# Altium schematic sheet 010_Current_Sensor.SchDoc
size A4; SheetNumber: 4; SheetTotal: 4; SPICEModelCacheXCDJKUEN: <root> / <DocumentId>XCDJKUEN</DocumentId> / <CacheFrame Number="0"> / <Model Name="875075761007_68uf" Kind="CKT"> / <Text>******* / .subckt 875075761007_68uF 1 2 / Rser 1 3 0.0108114773899 / Lser 2 4 5.10636587E-09 / C1 3 4 0.000068 / Rpar 3 4 73529.4117647059 / .ends 875075761007_68uF</Text> / </Model> / </CacheFrame> / </root>
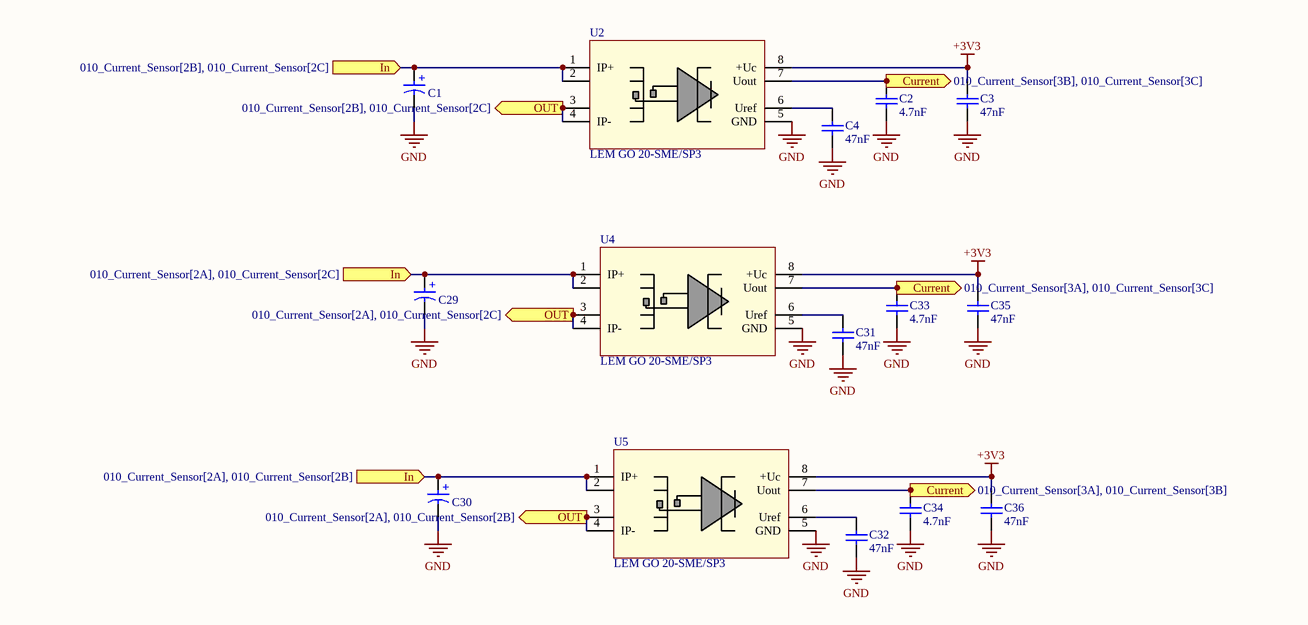
[diagram p0: 010_Current_Sensor.SchDoc]

## Parts
C1  68µF  [WCAP-PSLC_D10H12.4]  (value not drawn)
C2  4.7nF  [WCAP-CSGP_0805_L2W1.25H0.8_Reflow]
C3  47nF  [WCAP-CSGP_0805_L2W1.25H0.8_Reflow]
C4  47nF  [WCAP-CSGP_0805_L2W1.25H0.8_Reflow]
C29  68µF  [WCAP-PSLC_D10H12.4]  (value not drawn)
C30  68µF  [WCAP-PSLC_D10H12.4]  (value not drawn)
C31  47nF  [WCAP-CSGP_0805_L2W1.25H0.8_Reflow]
C32  47nF  [WCAP-CSGP_0805_L2W1.25H0.8_Reflow]
C33  4.7nF  [WCAP-CSGP_0805_L2W1.25H0.8_Reflow]
C34  4.7nF  [WCAP-CSGP_0805_L2W1.25H0.8_Reflow]
C35  47nF  [WCAP-CSGP_0805_L2W1.25H0.8_Reflow]
C36  47nF  [WCAP-CSGP_0805_L2W1.25H0.8_Reflow]
U2  LEM GO 20-SME/SP3  [Lem_sme_SOIC8]
U4  LEM GO 20-SME/SP3  [Lem_sme_SOIC8]
U5  LEM GO 20-SME/SP3  [Lem_sme_SOIC8]

## Ports
Current (out, see 010_Current_Sensor[3A], 010_Current_Sensor[3B]), Current (out, see 010_Current_Sensor[3A], 010_Current_Sensor[3C]), Current (out, see 010_Current_Sensor[3B], 010_Current_Sensor[3C]), In (in, see 010_Current_Sensor[2A], 010_Current_Sensor[2B]), In (in, see 010_Current_Sensor[2A], 010_Current_Sensor[2C]), In (in, see 010_Current_Sensor[2B], 010_Current_Sensor[2C]), OUT (out, see 010_Current_Sensor[2A], 010_Current_Sensor[2B]), OUT (out, see 010_Current_Sensor[2A], 010_Current_Sensor[2C]), OUT (out, see 010_Current_Sensor[2B], 010_Current_Sensor[2C])

## Nets
+3V3: C3.2 C35.2 C36.2 U2.8(+Uc) U4.8(+Uc) U5.8(+Uc)
GND: C1.2(N) C2.1 C3.1 C4.1 C29.2(N) C30.2(N) C31.1 C32.1 C33.1 C34.1 C35.1 C36.1 U2.5(GND) U4.5(GND) U5.5(GND)
Current: C2.2 C33.2 C34.2 U2.7(Uout) U4.7(Uout) U5.7(Uout) ; port Current
In: C1.1(P) C29.1(P) C30.1(P) U2.1(IP+) U2.2 U4.1(IP+) U4.2 U5.1(IP+) U5.2 ; port In
OUT: U2.3 U2.4(IP-) U4.3 U4.4(IP-) U5.3 U5.4(IP-) ; port OUT
NetC4_2: C4.2 U2.6(Uref)
NetC31_2: C31.2 U4.6(Uref)
NetC32_2: C32.2 U5.6(Uref)

## Notes on the sheet
- (in symbol 875075761007) +

## Library data of the parts
C1 C29 C30 = 875075761007: WCAP-PSLC Aluminum Polymer Capacitor, V-Chip SMT, D10 x H12.4mm, 68µF, 50V; Manufacturer: Wurth Elektronik; Capacitance Tolerance: +/-20%; Dissipation Factor: 12%; Endurance: 2000h; ESR: 35mΩ; Leakage Current: 680µA; Ripple Current: 2000mA; Technical Reference: PSEF124680M050DVCTFB000; Manufacturer Part Number: 875075761007; Category: Aluminum Polymer Capacitors; Match Code: WCAP-PSLC; ComponentLink1Description: Website Link; ComponentLink1URL: https://www.we-online.com/redexpert/article/875075761007?ad; ComponentLink2Description: Datasheet Link; ComponentLink2URL: https://www.we-online.com/redexpert/spec/875075761007?ad; Mount: Surface Mount; Operating Temperature Max: 105°C; Operating Temperature Min: -55°C; Packaging: Tape and Reel; Height: 12.4mm; Diameter: 10mm; Capacitance: 68µF; Rated Voltage (DC): 50V
C2 C33 C34 = 885012207090: WCAP-CSGP Multilayer Ceramic Chip Capacitor, General Purpose, size 0805, X7R, 4.7nF, 50VDC; Manufacturer: Wurth Elektronik; Case/Size Code: 0805; Capacitance Tolerance: +/-10%; Dissipation Factor: 2.5%; Insulation Resistance: 10GΩ; Rated Voltage (DC): 50V; Technical Reference: X7R0805472K050DFCT10000; Manufacturer Part Number: 885012207090; Category: Multilayer Ceramic Chip Capacitors; Match Code: WCAP-CSGP; ComponentLink1Description: Website Link; ComponentLink1URL: https://www.we-online.com/redexpert/article/885012207090?ad; ComponentLink2Description: Datasheet Link; ComponentLink2URL: https://www.we-online.com/redexpert/spec/885012207090?ad; Mount: Surface Mount; Operating Temperature Max: 125°C; Operating Temperature Min: -55°C; Packaging: Tape and Reel; Length: 2mm; Width: 1.25mm; Height: 0.8mm; Capacitance: 4.7nF; Ceramic Type: X7R
C3 C4 C31 C32 C35 C36 = 885012207096: WCAP-CSGP Multilayer Ceramic Chip Capacitor, General Purpose, size 0805, X7R, 47nF, 50VDC; Manufacturer: Wurth Elektronik; Case/Size Code: 0805; Capacitance Tolerance: +/-10%; Dissipation Factor: 2.5%; Insulation Resistance: 10GΩ; Rated Voltage (DC): 50V; Technical Reference: X7R0805473K050DFCT10000; Manufacturer Part Number: 885012207096; Category: Multilayer Ceramic Chip Capacitors; Match Code: WCAP-CSGP; ComponentLink1Description: Website Link; ComponentLink1URL: https://www.we-online.com/redexpert/article/885012207096?ad; ComponentLink2Description: Datasheet Link; ComponentLink2URL: https://www.we-online.com/redexpert/spec/885012207096?ad; Mount: Surface Mount; Operating Temperature Max: 125°C; Operating Temperature Min: -55°C; Packaging: Tape and Reel; Length: 2mm; Width: 1.25mm; Height: 0.8mm; Capacitance: 47nF; Ceramic Type: X7R
U2 U4 U5 = LEM_SME: Integrated Current Transducer GO-SME s; ComponentLink1Description: Datasheet; ComponentLink1URL: https://www.lem.com/sites/default/files/products_datasheets/go-sme_series.pdf; Manufacturer: LEM; Ordering Number: GO 20-SME/SP3